# EAGLE schematic Highlights shematics (EAGLE 6.5.0)
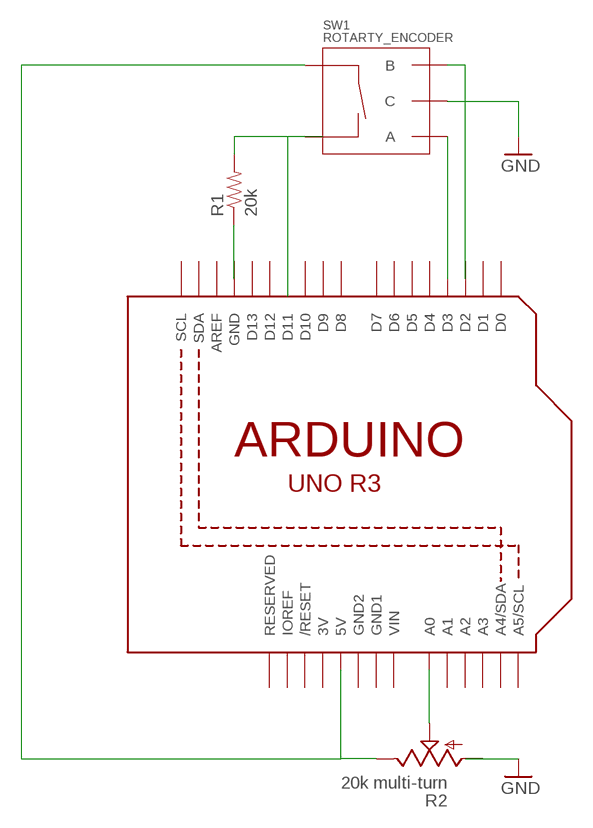
[diagram p0: schematic, sheet 1]

## Parts
R1  20k  RESISTORPTH-1/4W  [AXIAL-0.4]
R2  20k multi-turn  TRIM_US-CIP20C-6MM  [CIP20C-6MM]
SW1  ROTARTY_ENCODER  [ROTARY_ENC_PLAIN]
U1  ARDUINOR3-BPLACE  [ARDUINOR3-BPLACE]

## Nets
GND: SW1.C
N$1: SW1.SW-
N$2: R1.P$1
N$3: R1.P$2
N$4: SW1.A
N$5: SW1.B
N$6: R2.E SW1.SW+
N$7: R2.S
Unconnected: R2.A U1.A0 U1.A1 U1.A2 U1.A3 U1.A4(A4/SDA) U1.A5(A5/SCL) U1.AREF U1.D0 U1.D1 U1.D2 U1.D3 U1.D4 U1.D5 U1.D6 U1.D7 U1.D8 U1.D9 U1.D10 U1.D11 U1.D12 U1.D13 U1.IOREF U1.RESERVED U1.RESET(/RESET) U1.SCL U1.SDA

## Power pins joined to a net without a drawn wire
3V: U1.3V
5V: U1.5V
GND: U1.GND
GND1: U1.GND1
GND2: U1.GND2
VIN: U1.VIN

## Library data of the parts
R1 = SparkFun-Passives:RESISTOR: Resistor Basic schematic elements and footprints for 0603, 1206, and PTH resistors.
R2 = pot:TRIM_US-: POTENTIOMETER
SW1 = SparkFun-Electromechanical:ROTARTY_ENCODER: Simple no LED rotary encoder Example: COM-09117
U1 = adafruit:ARDUINOR3: This is a new object for the new Arduino R3 - with extra pins that you may want to use (such as IOref, and duplicated A4/A5